# EAGLE schematic ARM_board (EAGLE 6.5.0)
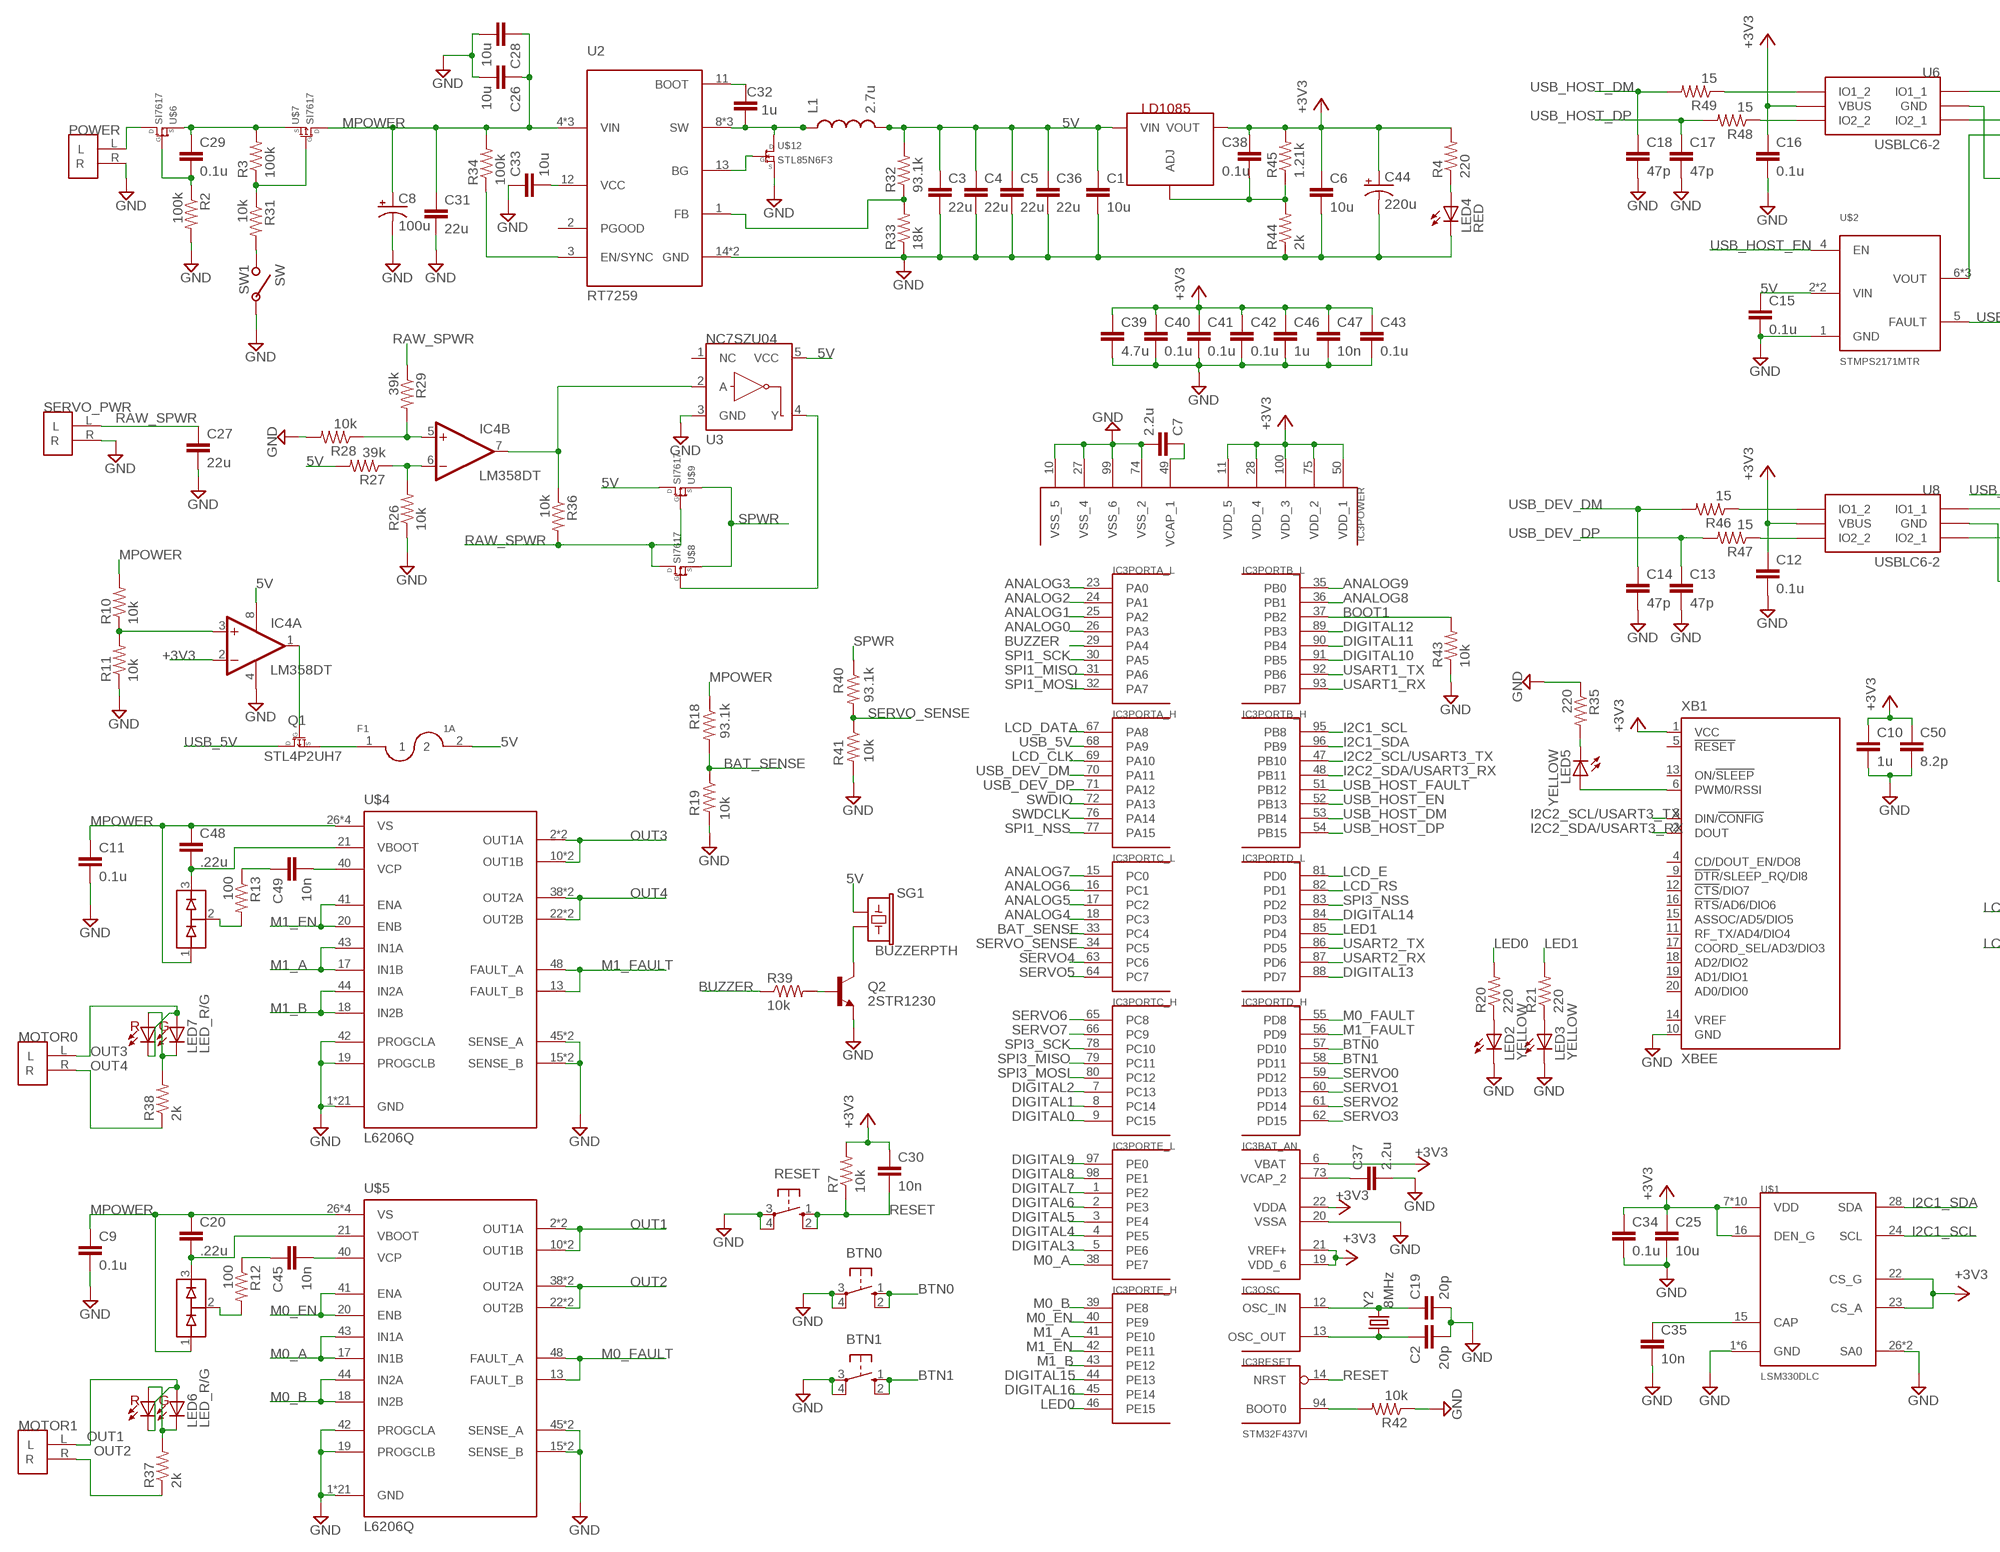
[diagram p0: schematic, sheet 1, part 1 of 2]
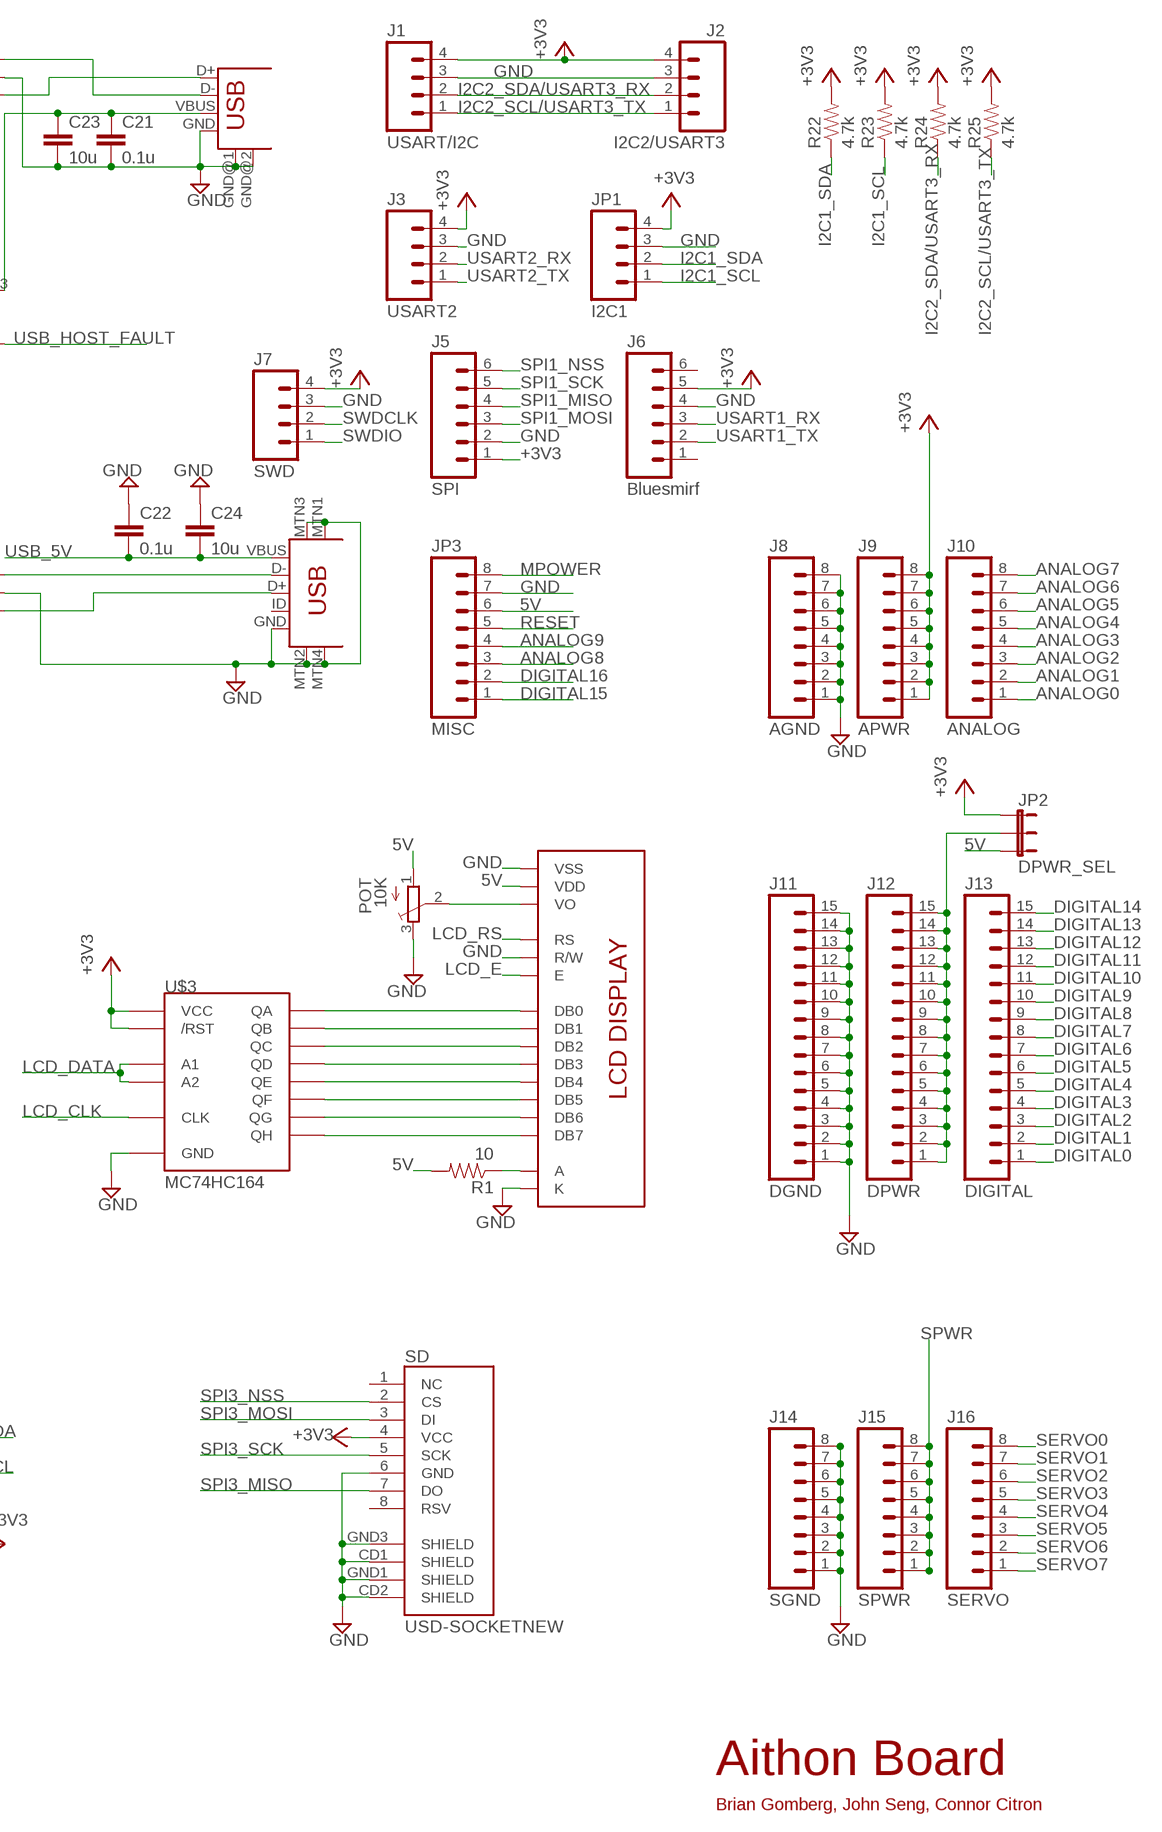
[diagram p1: schematic, sheet 1, part 2 of 2]

## Parts
BTN0  10-XX  [B3F-10XX]
BTN1  10-XX  [B3F-10XX]
C1  10u  CAP0603-CAP  [0603-CAP]
C2  20p  CAP0402-CAP  [0402-CAP]
C3  22u  CAP0805  [0805]
C4  22u  CAP0805  [0805]
C5  22u  CAP0805  [0805]
C6  10u  CAP0603-CAP  [0603-CAP]
C7  2.2u  CAP0402-CAP  [0402-CAP]
C8  100u  CAP_POLD  [PANASONIC_D]
C9  0.1u  CAP0603-CAP  [0603-CAP]
C10  1u  CAP0603-CAP  [0603-CAP]
C11  0.1u  CAP0805  [0805]
C12  0.1u  CAP0402-CAP  [0402-CAP]
C13  47p  CAP0402-CAP  [0402-CAP]
C14  47p  CAP0402-CAP  [0402-CAP]
C15  0.1u  CAP0402-CAP  [0402-CAP]
C16  0.1u  CAP0402-CAP  [0402-CAP]
C17  47p  CAP0402-CAP  [0402-CAP]
C18  47p  CAP0402-CAP  [0402-CAP]
C19  20p  CAP0402-CAP  [0402-CAP]
C20  .22u  CAP0402-CAP  [0402-CAP]
C21  0.1u  CAP0402-CAP  [0402-CAP]
C22  0.1u  CAP0402-CAP  [0402-CAP]
C23  10u  CAP0805  [0805]
C24  10u  CAP0805  [0805]
C25  10u  CAP0603-CAP  [0603-CAP]
C26  10u  CAP0805  [0805]
C27  22u  CAP1206  [1206]
C28  10u  CAP0805  [0805]
C29  0.1u  CAP0402-CAP  [0402-CAP]
C30  10n  CAP0402-CAP  [0402-CAP]
C31  22u  CAP1206  [1206]
C32  1u  CAP0603-CAP  [0603-CAP]
C33  10u  CAP0603-CAP  [0603-CAP]
C34  0.1u  CAP0402-CAP  [0402-CAP]
C35  10n  CAP0402-CAP  [0402-CAP]
C36  22u  CAP0805  [0805]
C37  2.2u  CAP0402-CAP  [0402-CAP]
C38  0.1u  CAP0402-CAP  [0402-CAP]
C39  4.7u  CAP0603-CAP  [0603-CAP]
C40  0.1u  CAP0402-CAP  [0402-CAP]
C41  0.1u  CAP0402-CAP  [0402-CAP]
C42  0.1u  CAP0402-CAP  [0402-CAP]
C43  0.1u  CAP0402-CAP  [0402-CAP]
C44  220u  CAP_POLD  [PANASONIC_D]
C45  10n  CAP0402-CAP  [0402-CAP]
C46  1u  CAP0402-CAP  [0402-CAP]
C47  10n  CAP0402-CAP  [0402-CAP]
C48  .22u  CAP0402-CAP  [0402-CAP]
C49  10n  CAP0402-CAP  [0402-CAP]
C50  8.2p  CAP0402-CAP  [0402-CAP]
F1  1A  POLYFUSE  [1206]
IC3  STM32F437VI  STM32F407VET  [TQFP100]
IC4  LM358DT  LM358D  [SO08]
J1  USART/I2C  M04PTH  [1X04]
J2  I2C2/USART3  M04PTH  [1X04]
J3  USART2  M04PTH  [1X04]
J5  SPI  M06SIP  [1X06]
J6  Bluesmirf  M06SIP  [1X06]
J7  SWD  M04PTH  [1X04]
J8  AGND  M081X08  [1X08]
J9  APWR  M081X08  [1X08]
J10  ANALOG  M081X08  [1X08]
J11  DGND  M15  [1X15]
J12  DPWR  M15  [1X15]
J13  DIGITAL  M15  [1X15]
J14  SGND  M081X08  [1X08]
J15  SPWR  M081X08  [1X08]
J16  SERVO  M081X08  [1X08]
JP1  I2C1  M04PTH  [1X04]
JP2  DPWR_SEL  JUMPER-3PTH  [1X03]
JP3  MISC  M081X08  [1X08]
L1  2.7u  INDUCTOR  [INDUCTOR]
LCD  LCD_DISPLAY  [LCD]
LD1085  AP1084  [DPAK]
LED2  YELLOW  LEDCHIP-LED0603  [CHIP-LED0603]
LED3  YELLOW  LEDCHIP-LED0603  [CHIP-LED0603]
LED4  RED  LEDCHIP-LED0603  [CHIP-LED0603]
LED5  YELLOW  LEDCHIP-LED0603  [CHIP-LED0603]
LED6  LED_R/G  LED_BICOLOR  [LED-0606]
LED7  LED_R/G  LED_BICOLOR  [LED-0606]
MOTOR0  2POS_TERMINAL  [2POS_TERMINAL]
MOTOR1  2POS_TERMINAL  [2POS_TERMINAL]
POT  10K  POT  [POT]
POWER  2POS_TERMINAL  [2POS_TERMINAL]
Q1  STL4P2UH7  [POWERFLAT]
Q2  2STR1230  TRANSISTOR_NPNSOT23-3  [SOT23-3]
R1  10  RESISTOR0402-RES  [0402-RES]
R2  100k  RESISTOR0402-RES  [0402-RES]
R3  100k  RESISTOR0402-RES  [0402-RES]
R4  220  RESISTOR0402-RES  [0402-RES]
R7  10k  RESISTOR0402-RES  [0402-RES]
R10  10k  RESISTOR0402-RES  [0402-RES]
R11  10k  RESISTOR0402-RES  [0402-RES]
R12  100  RESISTOR0402-RES  [0402-RES]
R13  100  RESISTOR0402-RES  [0402-RES]
R18  93.1k  RESISTOR0402-RES  [0402-RES]
R19  10k  RESISTOR0402-RES  [0402-RES]
R20  220  RESISTOR0402-RES  [0402-RES]
R21  220  RESISTOR0402-RES  [0402-RES]
R22  4.7k  RESISTOR0402-RES  [0402-RES]
R23  4.7k  RESISTOR0402-RES  [0402-RES]
R24  4.7k  RESISTOR0402-RES  [0402-RES]
R25  4.7k  RESISTOR0402-RES  [0402-RES]
R26  10k  RESISTOR0402-RES  [0402-RES]
R27  39k  RESISTOR0402-RES  [0402-RES]
R28  10k  RESISTOR0402-RES  [0402-RES]
R29  39k  RESISTOR0402-RES  [0402-RES]
R31  10k  RESISTOR0402-RES  [0402-RES]
R32  93.1k  RESISTOR0402-RES  [0402-RES]
R33  18k  RESISTOR0402-RES  [0402-RES]
R34  100k  RESISTOR0402-RES  [0402-RES]
R35  220  RESISTOR0402-RES  [0402-RES]
R36  10k  RESISTOR0402-RES  [0402-RES]
R37  2k  RESISTOR0402-RES  [0402-RES]
R38  2k  RESISTOR0402-RES  [0402-RES]
R39  10k  RESISTOR0402-RES  [0402-RES]
R40  93.1k  RESISTOR0402-RES  [0402-RES]
R41  10k  RESISTOR0402-RES  [0402-RES]
R42  10k  RESISTOR0402-RES  [0402-RES]
R43  10k  RESISTOR0402-RES  [0402-RES]
R44  2k  RESISTOR0402-RES  [0402-RES]
R45  1.21k  RESISTOR0402-RES  [0402-RES]
R46  15  RESISTOR0402-RES  [0402-RES]
R47  15  RESISTOR0402-RES  [0402-RES]
R48  15  RESISTOR0402-RES  [0402-RES]
R49  15  RESISTOR0402-RES  [0402-RES]
RESET  10-XX  [B3F-10XX]
SD  USD-SOCKETNEW  [MICRO-SD-SOCKET-PP]
SERVO_PWR  2POS_TERMINAL  [2POS_TERMINAL]
SG1  BUZZERPTH  [BUZZER-12MM]
SW1  SW  [SW]
U2  RT7259  SWITCHING_REG  [WDFN-14L]
U3  NC7SZU04  INVERTER""  [SC70]
U6  USBLC6-2  [SOT23-6L]
U8  USBLC6-2  [SOT23-6L]
U$1  LSM330DLC  [LGA-28]
U$2  STMPS2171MTR  RT9715  [8-SOIC]
U$3  MC74HC164  [TSSOP-14]
U$4  L6206Q  [VFQFPN48]
U$5  L6206Q  [VFQFPN48]
U$6  SI7617  [POWERPAK1212-8]
U$7  SI7617  [POWERPAK1212-8]
U$8  SI7617  [POWERPAK1212-8]
U$9  SI7617  [POWERPAK1212-8]
U$10  BAV99  [SOT-23]
U$11  BAV99  [SOT-23]
U$12  STL85N6F3  [POWERFLAT5X6]
USB1  USB-A-S  [USB-A-S]
USB2  USB-MINIB-5PIN  [USB-MINIB]
XB1  XBEE  [XBEE]
Y2  8MHz  CRYSTALSMD  [HC49UP]

## Nets
5V: C1.1 C3.1 C4.1 C5.1 C15.1 C36.1 F1.2 IC4.8(P:V+) JP2.3 JP3.6 L1.P$2 LCD.VDD LD1085.3(VIN) POT.1(A) R1.2 R27.2 R32.2 SG1.+ U3.5(VCC) U$2.2(VIN) U$2.3(VIN) U$9.5(D) U$9.6(D) U$9.7(D) U$9.8(D) U$9.PAD(D)
+3V3: C6.1 C10.1 C12.1 C16.1 C25.1 C30.1 C34.1 C38.1 C39.1 C40.1 C41.1 C42.1 C43.1 C44.+ C46.1 C47.1 C50.1 IC3.6(BAT_AN:VBAT) IC3.11(POWER:VDD_5) IC3.19(BAT_AN:VDD_6) IC3.21(BAT_AN:VREF+) IC3.22(BAT_AN:VDDA) IC3.28(POWER:VDD_4) IC3.50(POWER:VDD_1) IC3.75(POWER:VDD_2) IC3.100(POWER:VDD_3) IC4.2(A:-IN) J1.4 J2.4 J3.4 J5.1 J6.5 J7.4 J9.1 J9.2 J9.3 J9.4 J9.5 J9.6 J9.7 J9.8 JP1.4 JP2.1 LD1085.TAB(VOUT) R4.2 R7.2 R22.2 R23.2 R24.2 R25.2 R45.2 SD.4(VCC) U6.P$5(VBUS) U8.P$5(VBUS) U$1.7(VDD) U$1.8(VDD) U$1.9(VDD) U$1.10(VDD) U$1.11(VDD) U$1.12(VDD) U$1.13(VDD) U$1.14(VDD) U$1.16(DEN_G) U$1.21(VDD) U$1.22(CS_G) U$1.23(CS_A) U$1.25(VDD) U$3.9(/RST) U$3.14(VCC) XB1.1(VCC)
ANALOG0: IC3.26(PORTA_L:PA3) J10.1
ANALOG1: IC3.25(PORTA_L:PA2) J10.2
ANALOG2: IC3.24(PORTA_L:PA1) J10.3
ANALOG3: IC3.23(PORTA_L:PA0) J10.4
ANALOG4: IC3.18(PORTC_L:PC3) J10.5
ANALOG5: IC3.17(PORTC_L:PC2) J10.6
ANALOG6: IC3.16(PORTC_L:PC1) J10.7
ANALOG7: IC3.15(PORTC_L:PC0) J10.8
ANALOG8: IC3.36(PORTB_L:PB1) JP3.3
ANALOG9: IC3.35(PORTB_L:PB0) JP3.4
BAT_SENSE: IC3.33(PORTC_L:PC4) R18.2 R19.1
BOOT1: IC3.37(PORTB_L:PB2) R43.2
BTN0: BTN0.1(S) BTN0.2(S1) IC3.57(PORTD_H:PD10)
BTN1: BTN1.1(S) BTN1.2(S1) IC3.58(PORTD_H:PD11)
BUZZER: IC3.29(PORTA_L:PA4) R39.1
DIGITAL0: IC3.9(PORTC_H:PC15) J13.1
DIGITAL1: IC3.8(PORTC_H:PC14) J13.2
DIGITAL2: IC3.7(PORTC_H:PC13) J13.3
DIGITAL3: IC3.5(PORTE_L:PE6) J13.4
DIGITAL4: IC3.4(PORTE_L:PE5) J13.5
DIGITAL5: IC3.3(PORTE_L:PE4) J13.6
DIGITAL6: IC3.2(PORTE_L:PE3) J13.7
DIGITAL7: IC3.1(PORTE_L:PE2) J13.8
DIGITAL8: IC3.98(PORTE_L:PE1) J13.9
DIGITAL9: IC3.97(PORTE_L:PE0) J13.10
DIGITAL10: IC3.91(PORTB_L:PB5) J13.11
DIGITAL11: IC3.90(PORTB_L:PB4) J13.12
DIGITAL12: IC3.89(PORTB_L:PB3) J13.13
DIGITAL13: IC3.88(PORTD_L:PD7) J13.14
DIGITAL14: IC3.84(PORTD_L:PD3) J13.15
DIGITAL15: IC3.44(PORTE_H:PE13) JP3.1
DIGITAL16: IC3.45(PORTE_H:PE14) JP3.2
GND: BTN0.3(P) BTN0.4(P1) BTN1.3(P) BTN1.4(P1) C1.2 C2.2 C3.2 C4.2 C5.2 C6.2 C7.2 C8.- C9.2 C10.2 C11.2 C12.2 C13.2 C14.2 C15.2 C16.2 C17.2 C18.2 C19.2 C21.2 C22.1 C23.2 C24.1 C25.2 C26.2 C27.2 C28.2 C31.2 C33.1 C34.2 C35.2 C36.2 C37.2 C39.2 C40.2 C41.2 C42.2 C43.2 C44.- C46.2 C47.2 C50.2 IC3.10(POWER:VSS_5) IC3.20(BAT_AN:VSSA) IC3.27(POWER:VSS_4) IC3.74(POWER:VSS_2) IC3.99(POWER:VSS_6) IC4.4(P:V-) J1.3 J2.3 J3.3 J5.2 J6.4 J7.3 J8.1 J8.2 J8.3 J8.4 J8.5 J8.6 J8.7 J8.8 J11.1 J11.2 J11.3 J11.4 J11.5 J11.6 J11.7 J11.8 J11.9 J11.10 J11.11 J11.12 J11.13 J11.14 J11.15 J14.1 J14.2 J14.3 J14.4 J14.5 J14.6 J14.7 J14.8 JP1.3 JP3.7 LCD.K LCD.R/W LCD.VSS LED2.C LED3.C LED4.C POT.3(E) POWER.R Q2.2(E) R2.2 R11.1 R19.2 R26.1 R28.2 R33.1 R35.1 R41.2 R42.1 R43.1 R44.1 RESET.3(P) RESET.4(P1) SD.6(GND) SD.CD1(SHIELD) SD.CD2(SHIELD) SD.GND1(SHIELD) SD.GND3(SHIELD) SERVO_PWR.R SW1.P$2 U2.14(GND) U2.P$1(GND) U3.3(GND) U6.P$2(GND) U8.P$2(GND) U$1.1(GND) U$1.2(GND) U$1.3(GND) U$1.4(GND) U$1.5(GND) U$1.6(GND) U$1.26(SA0) U$1.27(SA0) U$2.1(GND) U$3.7(GND) U$4.1(GND) U$4.4(GND) U$4.5(GND) U$4.6(GND) U$4.7(GND) U$4.8(GND) U$4.9(GND) U$4.12(GND) U$4.14(GND) U$4.15(SENSE_B) U$4.16(SENSE_B) U$4.19(PROGCLB) U$4.24(GND) U$4.25(GND) U$4.28(GND) U$4.29(GND) U$4.30(GND) U$4.31(GND) U$4.32(GND) U$4.33(GND) U$4.36(GND) U$4.37(GND) U$4.42(PROGCLA) U$4.45(SENSE_A) U$4.46(SENSE_A) U$4.47(GND) U$4.PAD(GND) U$5.1(GND) U$5.4(GND) U$5.5(GND) U$5.6(GND) U$5.7(GND) U$5.8(GND) U$5.9(GND) U$5.12(GND) U$5.14(GND) U$5.15(SENSE_B) U$5.16(SENSE_B) U$5.19(PROGCLB) U$5.24(GND) U$5.25(GND) U$5.28(GND) U$5.29(GND) U$5.30(GND) U$5.31(GND) U$5.32(GND) U$5.33(GND) U$5.36(GND) U$5.37(GND) U$5.42(PROGCLA) U$5.45(SENSE_A) U$5.46(SENSE_A) U$5.47(GND) U$5.PAD(GND) U$12.1(S) U$12.2(S) U$12.3(S) USB1.GND USB1.GND@1(GND) USB1.GND@2(GND) USB2.GND USB2.MTN1(MTN2) USB2.MTN2(MTN3) USB2.MTN3(MTN1) USB2.MTN4 XB1.10(GND)
I2C1_SCL: IC3.95(PORTB_H:PB8) JP1.1 R23.1 U$1.24(SCL)
I2C1_SDA: IC3.96(PORTB_H:PB9) JP1.2 R22.1 U$1.28(SDA)
I2C2_SCL/USART3_TX: IC3.47(PORTB_H:PB10) J1.1 J2.1 R25.1 XB1.3(DIN/!CONFIG)
I2C2_SDA/USART3_RX: IC3.48(PORTB_H:PB11) J1.2 J2.2 R24.1 XB1.2(DOUT)
LCD_CLK: IC3.69(PORTA_H:PA10) U$3.8(CLK)
LCD_DATA: IC3.67(PORTA_H:PA8) U$3.1(A1) U$3.2(A2)
LCD_E: IC3.81(PORTD_L:PD0) LCD.E
LCD_RS: IC3.82(PORTD_L:PD1) LCD.RS
LED0: IC3.46(PORTE_H:PE15) R20.2
LED1: IC3.85(PORTD_L:PD4) R21.2
M0_A: IC3.38(PORTE_L:PE7) U$5.17(IN1B) U$5.43(IN1A)
M0_B: IC3.39(PORTE_H:PE8) U$5.18(IN2B) U$5.44(IN2A)
M0_EN: IC3.40(PORTE_H:PE9) U$5.20(ENB) U$5.41(ENA)
M0_FAULT: IC3.55(PORTD_H:PD8) U$5.13(FAULT_B) U$5.48(FAULT_A)
M1_A: IC3.41(PORTE_H:PE10) U$4.17(IN1B) U$4.43(IN1A)
M1_B: IC3.43(PORTE_H:PE12) U$4.18(IN2B) U$4.44(IN2A)
M1_EN: IC3.42(PORTE_H:PE11) U$4.20(ENB) U$4.41(ENA)
M1_FAULT: IC3.56(PORTD_H:PD9) U$4.13(FAULT_B) U$4.48(FAULT_A)
MPOWER: C8.+ C9.1 C11.1 C20.1 C26.1 C28.1 C31.1 C48.1 JP3.8 R10.2 R18.1 R34.2 U2.4(VIN) U2.5(VIN) U2.6(VIN) U$4.26(VS) U$4.27(VS) U$4.34(VS) U$4.35(VS) U$5.26(VS) U$5.27(VS) U$5.34(VS) U$5.35(VS) U$7.5(D) U$7.6(D) U$7.7(D) U$7.8(D) U$7.PAD(D) U$10.1 U$11.1
N$1: POWER.L U$6.5(D) U$6.6(D) U$6.7(D) U$6.8(D) U$6.PAD(D)
N$2: C29.2 R2.1 U$6.4(G)
N$3: IC3.94(RESET:BOOT0) R42.2
N$4: C37.1 IC3.73(BAT_AN:VCAP_2)
N$5: IC4.3(A:+IN) R10.1 R11.2
N$6: R46.1 U8.P$6(IO1_2)
N$7: U8.P$1(IO1_1) USB2.D-
N$8: U8.P$3(IO2_1) USB2.D+
N$9: LED4.A R4.1
N$10: C32.2 L1.P$1 U2.8(SW) U2.9(SW) U2.10(SW) U$12.5(D)
N$11: C35.1 U$1.15(CAP)
N$12: IC4.5(B:+IN) R28.1 R29.2
N$13: U6.P$3(IO2_1) USB1.D+
N$14: IC4.1(A:OUT) Q1.3(G)
N$15: F1.1 Q1.4(S) Q1.7(S)
N$16: U6.P$1(IO1_1) USB1.D-
N$17: R32.1 R33.2 U2.1(FB)
N$18: LED5.C R35.2
N$19: J12.1 J12.2 J12.3 J12.4 J12.5 J12.6 J12.7 J12.8 J12.9 J12.10 J12.11 J12.12 J12.13 J12.14 J12.15 JP2.2
N$20: C33.2 U2.12(VCC)
N$21: C21.1 C23.1 U$2.6(VOUT) U$2.7(VOUT) U$2.8(VOUT) USB1.VBUS
N$22: R31.2 SW1.P$1
N$23: C29.1 R3.2 U$6.1(S) U$6.2(S) U$6.3(S) U$7.1(S) U$7.2(S) U$7.3(S)
N$24: C7.1 IC3.49(POWER:VCAP_1)
N$25: C32.1 U2.11(BOOT)
N$26: IC4.6(B:-IN) R26.2 R27.1
N$27: IC4.7(B:OUT) R36.1 U3.2(A)
N$28: Q2.3(C) SG1.-
N$29: LED5.A XB1.6(PWM0/RSSI)
N$30: U3.4(Y) U$8.4(G)
N$31: LCD.VO POT.2(S)
N$32: C38.2 LD1085.1(ADJ) R44.2 R45.1
N$33: R47.1 U8.P$4(IO2_2)
N$34: R48.1 U6.P$4(IO2_2)
N$35: U2.13(BG) U$12.4(G)
N$36: R49.1 U6.P$6(IO1_2)
N$37: C45.1 R12.1
N$38: C45.2 U$5.40(VCP)
N$39: C20.2 U$5.21(VBOOT) U$10.3
N$40: R12.2 U$10.2
N$41: C49.1 R13.1
N$42: LED2.A R20.1
N$43: LED3.A R21.1
N$44: R34.1 U2.3(EN/SYNC)
N$45: C49.2 U$4.40(VCP)
N$46: C19.1 IC3.12(OSC:OSC_IN) Y2.2
N$47: C2.1 IC3.13(OSC:OSC_OUT) Y2.1
N$48: C48.2 U$4.21(VBOOT) U$11.3
N$49: R13.2 U$11.2
N$51: LED6.1 LED6.4 R37.2
N$52: LED7.1 LED7.4 R38.2
N$54: LCD.A R1.1
N$58: LCD.DB0 U$3.3(QA)
N$60: LCD.DB1 U$3.4(QB)
N$61: LCD.DB2 U$3.5(QC)
N$62: LCD.DB3 U$3.6(QD)
N$63: LCD.DB4 U$3.10(QE)
N$64: LCD.DB5 U$3.11(QF)
N$65: Q2.1(B) R39.2
N$68: R3.1 R31.1 U$7.4(G)
N$70: LCD.DB6 U$3.12(QG)
N$71: LCD.DB7 U$3.13(QH)
OUT1: LED6.2 LED6.3 MOTOR1.L U$5.2(OUT1A) U$5.3(OUT1A) U$5.10(OUT1B) U$5.11(OUT1B)
OUT2: MOTOR1.R R37.1 U$5.22(OUT2B) U$5.23(OUT2B) U$5.38(OUT2A) U$5.39(OUT2A)
OUT3: LED7.2 LED7.3 MOTOR0.L U$4.2(OUT1A) U$4.3(OUT1A) U$4.10(OUT1B) U$4.11(OUT1B)
OUT4: MOTOR0.R R38.1 U$4.22(OUT2B) U$4.23(OUT2B) U$4.38(OUT2A) U$4.39(OUT2A)
RAW_SPWR: C27.1 R29.1 R36.2 SERVO_PWR.L U$8.5(D) U$8.6(D) U$8.7(D) U$8.8(D) U$8.PAD(D) U$9.4(G)
RESET: C30.2 IC3.14(RESET:NRST) JP3.5 R7.1 RESET.1(S) RESET.2(S1)
SERVO0: IC3.59(PORTD_H:PD12) J16.8
SERVO1: IC3.60(PORTD_H:PD13) J16.7
SERVO2: IC3.61(PORTD_H:PD14) J16.6
SERVO3: IC3.62(PORTD_H:PD15) J16.5
SERVO4: IC3.63(PORTC_L:PC6) J16.4
SERVO5: IC3.64(PORTC_L:PC7) J16.3
SERVO6: IC3.65(PORTC_H:PC8) J16.2
SERVO7: IC3.66(PORTC_H:PC9) J16.1
SERVO_SENSE: IC3.34(PORTC_L:PC5) R40.2 R41.1
SPI1_MISO: IC3.31(PORTA_L:PA6) J5.4
SPI1_MOSI: IC3.32(PORTA_L:PA7) J5.3
SPI1_NSS: IC3.77(PORTA_H:PA15) J5.6
SPI1_SCK: IC3.30(PORTA_L:PA5) J5.5
SPI3_MISO: IC3.79(PORTC_H:PC11) SD.7(DO)
SPI3_MOSI: IC3.80(PORTC_H:PC12) SD.3(DI)
SPI3_NSS: IC3.83(PORTD_L:PD2) SD.2(CS)
SPI3_SCK: IC3.78(PORTC_H:PC10) SD.5(SCK)
SPWR: J15.1 J15.2 J15.3 J15.4 J15.5 J15.6 J15.7 J15.8 R40.1 U$8.1(S) U$8.2(S) U$8.3(S) U$9.1(S) U$9.2(S) U$9.3(S)
SWDCLK: IC3.76(PORTA_H:PA14) J7.2
SWDIO: IC3.72(PORTA_H:PA13) J7.1
USART1_RX: IC3.93(PORTB_L:PB7) J6.3
USART1_TX: IC3.92(PORTB_L:PB6) J6.2
USART2_RX: IC3.87(PORTD_L:PD6) J3.2
USART2_TX: IC3.86(PORTD_L:PD5) J3.1
USB_5V: C22.2 C24.2 IC3.68(PORTA_H:PA9) Q1.1(D) Q1.2(D) Q1.5(D) Q1.6(D) Q1.8(D) USB2.VBUS
USB_DEV_DM: C14.1 IC3.70(PORTA_H:PA11) R46.2
USB_DEV_DP: C13.1 IC3.71(PORTA_H:PA12) R47.2
USB_HOST_DM: C18.1 IC3.53(PORTB_H:PB14) R49.2
USB_HOST_DP: C17.1 IC3.54(PORTB_H:PB15) R48.2
USB_HOST_EN: IC3.52(PORTB_H:PB13) U$2.4(EN)
USB_HOST_FAULT: IC3.51(PORTB_H:PB12) U$2.5(FAULT)
Unconnected: J6.1 J6.6 SD.1(NC) SD.8(RSV) U2.2(PGOOD) U3.1(NC) USB2.ID XB1.4(CD/DOUT_EN/DO8) XB1.5(!RESET) XB1.9(!DTR!/SLEEP_RQ/DI8) XB1.11(RF_TX/AD4/DIO4) XB1.12(!CTS!/DIO7) XB1.13(ON/!SLEEP) XB1.14(VREF) XB1.15(ASSOC/AD5/DIO5) XB1.16(!RTS!/AD6/DIO6) XB1.17(COORD_SEL/AD3/DIO3) XB1.18(AD2/DIO2) XB1.19(AD1/DIO1) XB1.20(AD0/DIO0)

## Notes on the sheet
- Aithon Board
- Brian Gomberg, John Seng, Connor Citron

## Library data of the parts
BTN0 BTN1 RESET = switch-omron:10-XX: OMRON SWITCH; MPN: B3F-1000; OC_FARNELL: 176432; OC_NEWARK: 36M3542
C1-C7 C9-C43 C45-C50 = SparkFun:CAP: Capacitor Standard 0603 ceramic capacitor, and 0.1" leaded capacitor.
C8 C44 = SparkFun:CAP_POL: Capacitor Polarized These are standard SMD and PTH capacitors. Normally 10uF, 47uF, and 100uF in electrolytic and tantalum varieties. Always verify the external diameter of the through hole cap, it varies with capacity, voltage, and manufacturer. The EIA devices should be standard.
F1 = r_cubed:POLYFUSE
IC3 = new_parts:STM32F407VET: STM32F405/407 100 pin LQFP
IC4 = linear:LM358: OP AMP also LM158; LM258; LM2904 Source: http://cache.national.com/ds/LM/LM158.pdf
J1-J3 J7 JP1 = SparkFun:M04: Header 4 Standard 4-pin 0.1" header. Use with straight break away headers (SKU : PRT-00116), right angle break away headers (PRT-00553), swiss pins (PRT-00743), machine pins (PRT-00117), and female headers (PRT-00115). Molex polarized connector foot print use with SKU : PRT-08231 with associated crimp pins and housings. 1MM SMD Version SKU: PRT-10208
J5 J6 = SparkFun:M06: Header 6 Standard 6-pin 0.1" header. Use with straight break away headers (SKU : PRT-00116), right angle break away headers (PRT-00553), swiss pins (PRT-00743), machine pins (PRT-00117), and female headers (PRT-00115). Molex polarized connector foot print use with SKU : PRT-08094 with associated crimp pins and housings. NOTES ON THE VARIANTS LOCK and LOCK_LONGPADS... This footprint was designed to help hold the alignment of a through-hole component (i.e. 6-pin header) while soldering it into place. You may notice that each hole has been shifted either up or down by 0.005 of an inch from it's more standard position (which is a perfectly straight line). This slight alteration caused the pins (the squares in the middle) to touch the edges of the holes. Because they are alternating, it causes a "brace" to hold the component in place. 0.005 has proven to be the perfect amount of "off-center" position when using our standard breakaway headers. Although looks a little odd when you look at the bare footprint, once you have a header in there, the alteration is very hard to notice. Also, if you push a header all the way into place, it is covered up entirely on the bottom side. This idea of altering the position of holes to aid alignment will be further integrated into the Sparkfun Library for other footprints. It can help hold any component with 3 or more connection pins.
J8-J10 J14-J16 JP3 = SparkFun:M08: Header 8 Standard 8-pin 0.1" header. Use with straight break away headers (SKU : PRT-00116), right angle break away headers (PRT-00553), swiss pins (PRT-00743), machine pins (PRT-00117), and female headers (PRT-00115).
J11-J13 = SparkFun:M15: Header 15 Standard 15-pin 0.1" header. Use with straight break away headers (SKU : PRT-00116), right angle break away headers (PRT-00553), swiss pins (PRT-00743), machine pins (PRT-00117), and female headers (PRT-00115).
JP2 = SparkFun:JUMPER-3
L1 = r_cubed:INDUCTOR
LCD = arduinoShield:LCD_DISPLAY
LD1085 = r_cubed:AP1084
LED2-LED5 = led:LED: LED OSRAM: - CHIPLED LG R971, LG N971, LY N971, LG Q971, LY Q971, LO R971, LY R971 LH N974, LH R974 LS Q976, LO Q976, LY Q976 LO Q996 - Hyper CHIPLED LW Q18S LB Q993, LB Q99A, LB R99A - SideLED LS A670, LO A670, LY A670, LG A670, LP A670 LB A673, LV A673, LT A673, LW A673 LH A674 LY A675 LS A676, LA A676, LO A676, LY A676, LW A676 LS A679, LY A679, LG A679 - Hyper Micro SIDELED® LS Y876, LA Y876, LO Y876, LY Y876 LT Y87S - SmartLED LW L88C, LW L88S LB L89C, LB L89S, LG L890 LS L89K, LO L89K, LY L89K LS L896, LA L896, LO L896, LY L896 - TOPLED LS T670, LO T670, LY T670, LG T670, LP T670 LSG T670, LSP T670, LSY T670, LOP T670, LYG T670 LG T671, LOG T671, LSG T671 LB T673, LV T673, LT T673, LW T673 LH T674 LS T676, LA T676, LO T676, LY T676, LB T676, LH T676, LSB T676, LW T676 LB T67C, LV T67C, LT T67C, LS T67K, LO T67K, LY T67K, LW E67C LS E67B, LA E67B, LO E67B, LY E67B, LB E67C, LV E67C, LT E67C LW T67C LS T679, LY T679, LG T679 LS T770, LO T770, LY T770, LG T770, LP T770 LB T773, LV T773, LT T773, LW T773 LH T774 LS E675, LA E675, LY E675, LS T675 LS T776, LA T776, LO T776, LY T776, LB T776 LHGB T686 LT T68C, LB T68C - Hyper Mini TOPLED® LB M676 - Mini TOPLED Santana® LG M470 LS M47K, LO M47K, LY M47K Source: http://www.osram.convergy.de LUXEON: - LUMILED® LXK2-PW12-R00, LXK2-PW12-S00, LXK2-PW14-U00, LXK2-PW14-V00 LXK2-PM12-R00, LXK2-PM12-S00, LXK2-PM14-U00 LXK2-PE12-Q00, LXK2-PE12-R00, LXK2-PE12-S00, LXK2-PE14-T00, LXK2-PE14-U00 LXK2-PB12-K00, LXK2-PB12-L00, LXK2-PB12-M00, LXK2-PB14-N00, LXK2-PB14-P00, LXK2-PB14-Q00 LXK2-PR12-L00, LXK2-PR12-M00, LXK2-PR14-Q00, LXK2-PR14-R00 LXK2-PD12-Q00, LXK2-PD12-R00, LXK2-PD12-S00 LXK2-PH12-R00, LXK2-PH12-S00 LXK2-PL12-P00, LXK2-PL12-Q00, LXK2-PL12-R00 Source: www.luxeon.com KINGBRIGHT: KA-3528ASYC Source: www.kingbright.com
LED6 LED7 = r_cubed:LED_BICOLOR
MOTOR0 MOTOR1 POWER SERVO_PWR = r_cubed:2POS_TERMINAL
POT = r_cubed:POT
Q1 = r_cubed:STL4P2UH7
Q2 = SparkFun:TRANSISTOR_NPN: Transistor NPN BJT configuration in SOT23 package. MMBT2222 is the common NPN we use. Double check BCE configuration again layout.
R1-R4 R7 R10-R13 R18-R29 R31-R49 = SparkFun:RESISTOR: Resistor Basic schematic elements and footprints for 0603, 1206, and PTH resistors.
SD = SparkFun:USD-SOCKET: microSD Socket Push-push type uSD socket. Schematic element and footprint production proven. Spark Fun Electronics SKU : PRT-00127. tDoc lines correctly indicate media card edge positions when inserting (unlocked, locked, depressed).
SG1 = SparkFun:BUZZER: Buzzer 12mm Spark Fun Electronics SKU : Comp-Buzzer
SW1 = r_cubed:SW
U2 = r_cubed:SWITCHING_REG: RT7259 1028-1199-1-ND
U3 = SparkFun:INVERTER: Single inverter, SOT23-5
U6 U8 = new_parts:USBLC6-2: ST USBLC6-2
U$1 = r_cubed:LSM330DLC
U$2 = r_cubed:RT9715
U$3 = r_cubed:MC74HC164
U$4 U$5 = r_cubed:L6206Q
U$6-U$9 = r_cubed:SI7617
U$10 U$11 = Parts:BAV99
U$12 = r_cubed:STL85N6F3
USB1 = con-usb-2:USB: USB Connectors
USB2 = SparkFun:USB-MINIB: Mini-USB "B" connector with 5th pin broken out. Created new symbol breaking out 5th "ID" pin in mini/micro USB connector spec. See: http://en.wikipedia.org/wiki/Mini_usb#Cables. Uses same footprint as 4-pin symbol. Also added pins to connect to mounting / shield pads if required (probably not generally needed as signals aren't shielded once they leave the connector).
XB1 = maxstream:XBEE: XBee (TM) /XBee-PRO(TM) OEM RF Modules Source: MaxStream, Inc. xbee_productmanual.pdf; MPN: XBP24-Z7UIT-004; OC_FARNELL: 1751799; OC_NEWARK: 34R5507
Y2 = SparkFun:CRYSTAL: Crystals Various standard crystals. Proven footprints. Spark Fun Electronics SKU : COM-00534